# Altium schematic sheet ADC.SchDoc
size A4; SheetNumber: 2; SheetTotal: 6
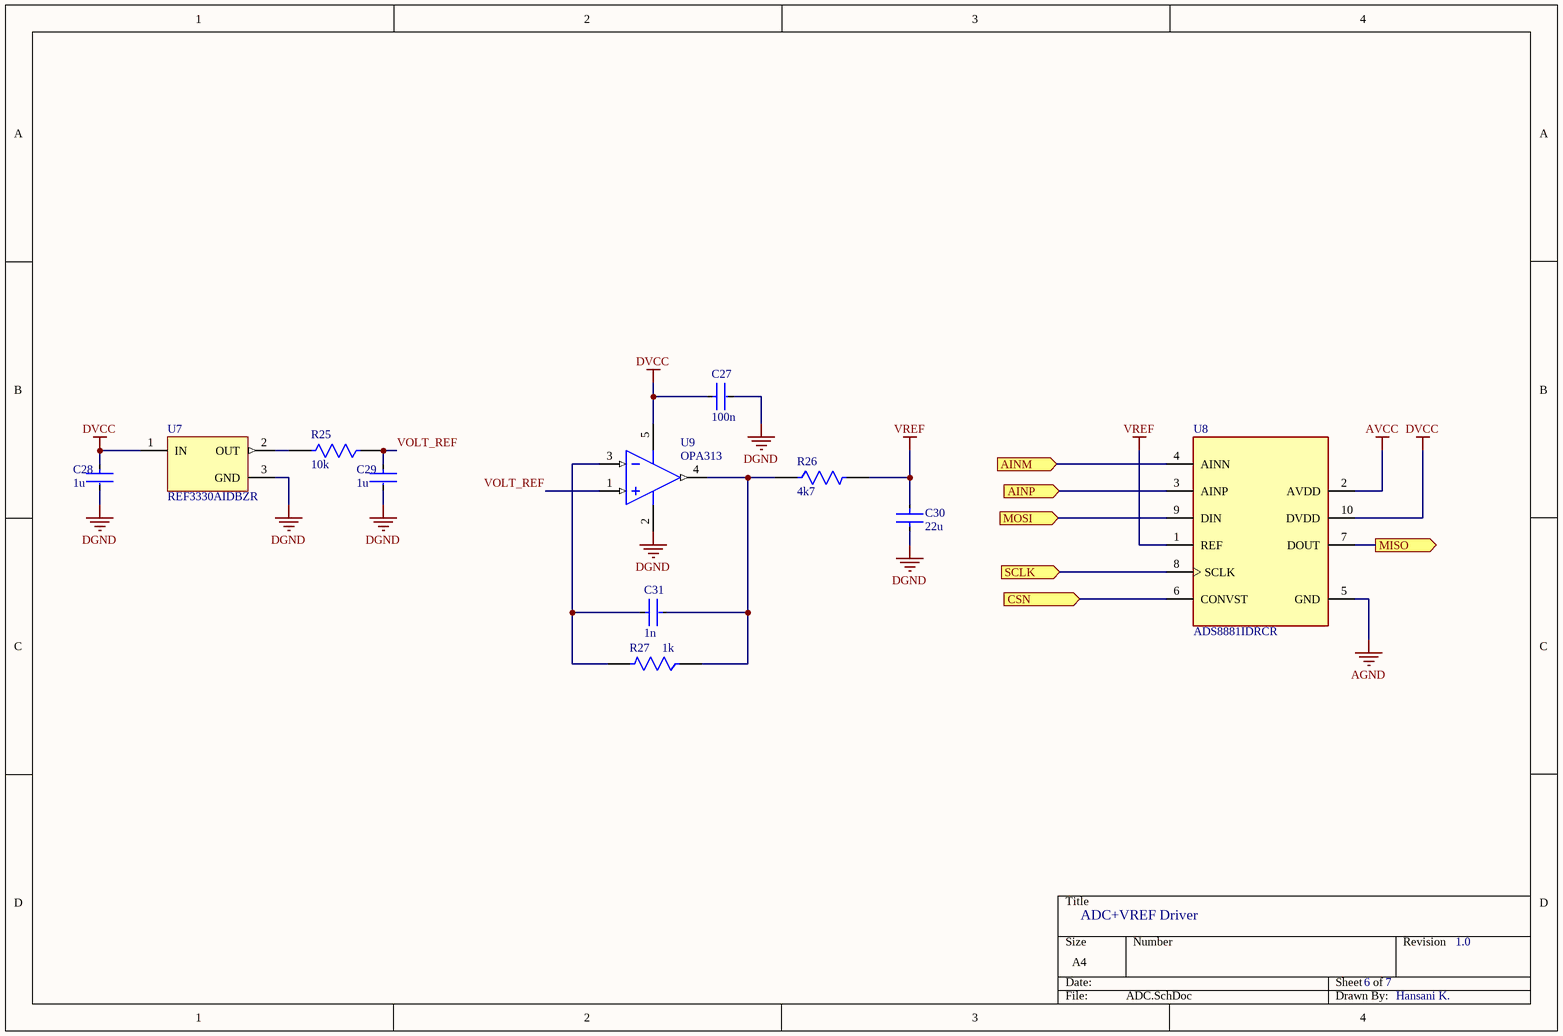
[diagram p0: ADC.SchDoc]

## Parts
C27  100n  [FP-GRM155-0_05-MFG]
C28  1u  [FP-0603-L_1_6_0_15-W_0_81-IPC_A]
C29  1u  [FP-0603-L_1_6_0_15-W_0_81-IPC_A]
C30  22u  [PCBComponent_1]
C31  1n  [PCBComponent_1]
R25  10k  [FP-CRGCQ0805-IPC_C]
R26  4k7  [FP-RN73R2A-IPC_C]
R27  1k  [FP-PATT0805-MFG]
U7  REF3330AIDBZR  [DBZ0003A_L]
U8  ADS8881IDRCR  [ADS8881IDRCR]
U9  OPA313  [DCK0005A_L]

## Ports
AINM (in, see Wireless_ECG_Monitor[3B], Input_Driver_ADC[3C]), AINP (in, see Wireless_ECG_Monitor[3B], Input_Driver_ADC[3B]), CSN (in, see Wireless_ECG_Monitor[3B], MCU[1C]), MISO (out, see Wireless_ECG_Monitor[3B], MCU[1C]), MOSI (in, see Wireless_ECG_Monitor[3B], MCU[1C]), SCLK (in, see Wireless_ECG_Monitor[3B], MCU[1C])

## Nets
AGND: U8.5(GND)
AVCC: U8.2(AVDD)
DGND: C27.2 C28.2 C29.2 C30.1 U7.3(GND) U9.2(V-)
DVCC: C27.1 C28.1 U7.1(IN) U8.10(DVDD) U9.5(V+)
VREF: C30.2 R26.2 U8.1(REF)
AINM: U8.4(AINN) ; port AINM
AINP: U8.3(AINP) ; port AINP
CSN: U8.6(CONVST) ; port CSN
MISO: U8.7(DOUT) ; port MISO
MOSI: U8.9(DIN) ; port MOSI
SCLK: U8.8(SCLK) ; port SCLK
VOLT_REF: C29.1 R25.1 U9.1(IN+)
NetC31_1: C31.1 R27.2 U9.3(IN-)
NetC31_2: C31.2 R26.1 R27.1 U9.4(OUT)
NetR25_2: R25.2 U7.2(OUT)

## Notes on the sheet
- ADC+VREF Driver
- 6
- 7
- 1.0
- Hansani K.

## Library data of the parts
C27 = CMP-06035-040303-1: Chip Multilayer Ceramic Capacitors for General Purpose, 0402, 0.10uF, B, 10%, 20%, 50V
C28 C29 = CMP-2006-04474-2: General Purpose Ceramic Capacitor, 0603, 1uF, 10%, X5R, 15%, 6.3V; Insulation Resistance: 100GR; Dissipation Factor: 5%; Package Quantity: 1; Mount: Surface Mount; Series: -; Number of Pins: 2; Length: 1.6mm; RoHS Compliant: Yes; Capacitance: 1uF; Depth: 0.81mm; Case Code (Imperial): 0603; Lead Free: Lead Free; Max Operating Temperature: 85°C; Case Code (Metric): 1608; Min Operating Temperature: -55°C; Contact Plating: Tin; Voltage: 6.3V; Tolerance: 10%; Width: 0.032inch; Voltage Rating (DC): 6.3V; Voltage Rating: 6.3V; Termination: SMD/SMT; Radiation Hardening: No; Case/Package: 0603; Thickness: 0.035inch; Height: 0.9mm; REACH SVHC: No SVHC; Packaging: Tape and Reel; Construction: Flat; Dielectric: X5R
C30 = CL21A226MAYNNNE: Ceramic Capacitor, Multilayer, Ceramic, 25V, 20% +Tol, 20% -Tol, X5R, +-15% TC, 22uF, Surface Mount, 0805 inch; Manufacturer: Samsung Electro-Mechanics; Value: 22µF; Supplier: Avnet; Supplier Part Number: CL21A226MAYNNNE; Manufacturer Part Number: CL21A226MAYNNNE; RoHS: Compliant; Category: Ceramic Capacitors; Stock: 1176000; Pricing: 2000=0.03409, 4000=0.03392, 8000=0.03375, 16000=0.03357, 32000=0.0334 (USD); Case/Package: 0805; China RoHS: Compliant; Dielectric: X5R; Dielectric Material: Ceramic; Height: 1.25mm; Length: 2mm; Lifecycle Status: Production; Material: Ceramic; Max Operating Temperature: 85°C; Min Operating Temperature: -55°C; Mounting Technology: Surface Mount; Number of Terminals: 2; REACH SVHC: Yes; Schedule B: 8532240020; Tolerance: 20%; Voltage Rating: 25V; Voltage Rating (DC): 25V; Width: 1.25mm; ComponentLink1URL: https://datasheet.octopart.com:443/CL21A226MAYNNNE-Samsung-Electro-Mechanics-datasheet-137343010.pdf?src-supplier=IHS; ComponentLink1Description: https://datasheet.octopart.com:443/CL21A226MAYNNNE-Samsung-Electro-Mechanics-datasheet-137343010.pdf?src-supplier=IHS; ComponentLink2URL: https://datasheet.octopart.com:443/CL21A226MAYNNNE-Samsung-Electro-Mechanics-datasheet-137126787.pdf?src-supplier=Newark; ComponentLink2Description: https://datasheet.octopart.com:443/CL21A226MAYNNNE-Samsung-Electro-Mechanics-datasheet-137126787.pdf?src-supplier=Newark; ComponentLink3URL: https://datasheet.octopart.com/CL21A226MAYNNNE-Samsung-Electro-Mechanics-datasheet-97040617.pdf; ComponentLink3Description: https://datasheet.octopart.com/CL21A226MAYNNNE-Samsung-Electro-Mechanics-datasheet-97040617.pdf; ComponentLink4URL: https://datasheet.octopart.com/CL21A226MAYNNNE-Samsung-Electro-Mechanics-datasheet-8324245.pdf; ComponentLink4Description: https://datasheet.octopart.com/CL21A226MAYNNNE-Samsung-Electro-Mechanics-datasheet-8324245.pdf; ComponentLink5URL: https://datasheet.octopart.com/General-Multilayer-Ceramic-Capacitors-Samsung-datasheet-family-111.pdf; ComponentLink5Description: https://datasheet.octopart.com/General-Multilayer-Ceramic-Capacitors-Samsung-datasheet-family-111.pdf; ComponentLink6URL: https://datasheet.octopart.com:443/CL21A226MAYNNNE-Samsung-datasheet-8326407.pdf?src-supplier=TME; ComponentLink6Description: https://datasheet.octopart.com:443/CL21A226MAYNNNE-Samsung-datasheet-8326407.pdf?src-supplier=TME; ComponentLink7URL: https://datasheet.octopart.com:443/CL21A226MAYNNNE-Samsung-Electro-Mechanics-datasheet-149154243.pdf?src-supplier=Future+Electronics; ComponentLink7Description: https://datasheet.octopart.com:443/CL21A226MAYNNNE-Samsung-Electro-Mechanics-datasheet-149154243.pdf?src-supplier=Future+Electronics; ComponentLink8URL: http://sigma.octopart.com:80/rohs_certificate/General-Multilayer-Ceramic-Capacitors-Samsung-family-110.pdf?src-supplier=Compliance+Statements; ComponentLink8Description: http://sigma.octopart.com:80/rohs_certificate/General-Multilayer-Ceramic-Capacitors-Samsung-family-110.pdf?src-supplier=Compliance+Statements; ComponentLink9URL: http://sigma.octopart.com:80/rohs_statement/General-Multilayer-Ceramic-Capacitors-Samsung-family-132.pdf?src-supplier=Compliance+Statements; ComponentLink9Description: http://sigma.octopart.com:80/rohs_statement/General-Multilayer-Ceramic-Capacitors-Samsung-family-132.pdf?src-supplier=Compliance+Statements; ComponentLink10URL: http://sigma.octopart.com:80/reach_statement/General-Multilayer-Ceramic-Capacitors-Samsung-family-133.pdf?src-supplier=Compliance+Statements; ComponentLink10Description: http://sigma.octopart.com:80/reach_statement/General-Multilayer-Ceramic-Capacitors-Samsung-family-133.pdf?src-supplier=Compliance+Statements
C31 = CS0805KRX7RBBB102: Ceramic Capacitor, Multilayer, Ceramic, 500V, 10% +Tol, 10% -Tol, X7R, 15% TC, 0.001uF, Surface Mount, 0805; Manufacturer: Yageo Group; Value: 1nF; Supplier: DigiKey; Supplier Part Number: 311-3593-1-ND; Manufacturer Part Number: CS0805KRX7RBBB102; RoHS: Compliant; Category: Ceramic Capacitors; Stock: 13349; Pricing: 1=0.32, 10=0.191, 50=0.14, 100=0.1241, 500=0.0976, 1000=0.08941 (USD); Case/Package: 0805; China RoHS: Compliant; Dielectric Material: Ceramic; Features: Soft Termination; Height: 850µm; Length: 2mm; Lifecycle Status: Production; Max Operating Temperature: 125°C; Min Operating Temperature: -55°C; Mounting Technology: Surface Mount; Number of Terminals: 2; REACH SVHC: Yes; Thickness: 990.6µm; Tolerance: 10%; Voltage Rating: 500V; Voltage Rating (DC): 500V; Width: 1.25mm; ComponentLink1URL: https://datasheet.octopart.com:443/CS0805KRX7RBBB102-Yageo-datasheet-176133326.pdf?src-supplier=IHS; ComponentLink1Description: https://datasheet.octopart.com:443/CS0805KRX7RBBB102-Yageo-datasheet-176133326.pdf?src-supplier=IHS; ComponentLink2URL: https://datasheet.octopart.com:443/CS0805KRX7RBBB102-Yageo-datasheet-158410602.pdf?src-supplier=Newark; ComponentLink2Description: https://datasheet.octopart.com:443/CS0805KRX7RBBB102-Yageo-datasheet-158410602.pdf?src-supplier=Newark; ComponentLink3URL: https://datasheet.octopart.com:443/CS0805KRX7RBBB102-Yageo-datasheet-182050863.pdf?src-supplier=Newark; ComponentLink3Description: https://datasheet.octopart.com:443/CS0805KRX7RBBB102-Yageo-datasheet-182050863.pdf?src-supplier=Newark; ComponentLink4URL: http://sigma.octopart.com:80/rohs_statement/Yageo-company-2.pdf?src-supplier=Compliance+Statements; ComponentLink4Description: http://sigma.octopart.com:80/rohs_statement/Yageo-company-2.pdf?src-supplier=Compliance+Statements; ComponentLink5URL: http://sigma.octopart.com:80/conflict_mineral_statement/Yageo-company-3.pdf?src-supplier=Compliance+Statements; ComponentLink5Description: http://sigma.octopart.com:80/conflict_mineral_statement/Yageo-company-3.pdf?src-supplier=Compliance+Statements
R25 = CMP-03211-002989-1: CRGCQ 0805 10K 5%; Manufacturer Part Number: CRGCQ0805J10K; Manufacturer: TE Connectivity; Voltage Rating: 150V; Temperature Coefficient: ±100ppm/°C; Resistance: 10KΩ; Value: 10KΩ; Power Rating: 0.125W; Tolerance: 0.05; Automotive Grade: Grade 914; Height: 0.65mm; Lead Free: Yes; Temperature Range High: +155°C; Composition: Thick Film; Temperature Range Low: -55°C; Ambient Temperature Range High: +70°C; Temperature: -55°C to +155°C; Package: CRGCQ0805; Device Class L2: Resistors; RoHS: TRUE; ComponentLink2URL: https://www.te.com/commerce/DocumentDelivery/DDEController?Action=showdoc&DocId=Data+Sheet%7F1773204-3%7F1%7Fpdf%7FEnglish%7FENG_DS_1773204-3_1.pdf%7F4-2176341-923; Series: CRGCQ; Device Class L1: Passive Components; Ipc Land Pattern Name: RESC200125X55; ComponentLink2Description: Datasheet; Category: Res; Digikey Description: CRGCQ 0805 10K 5%; Mouser Description: Res Thick Film 0805 10K Ohm 5% 0.125W(1/8W) ±100ppm/C Pad SMD Automotive T/R; Automotive: Yes; Octopart: https://octopart.com/crgcq0805j10k-te+connectivity-91018201; Device Class L3: Chip SMD Resistors
R26 = CMP-04015-010540-1: 4.7kΩ ±0.1% 0.125W, 1/8W Chip Resistor 0805 (2012 Metric) Moisture Resistant Thin Film
R27 = CMP-02407-000013-1: RES SMD 1K OHM 0.1% 1/5W 0805; Manufacturer Part Number: PATT0805E1001BGT1; Manufacturer: Vishay; Automotive Grade: Grade 0; Resistance: 1kΩ; Voltage Rating: 100V; Temperature Coefficient: 25ppm/°C; Value: 1kΩ; Power Rating: 200mW; ComponentLink2Description: Datasheet; Device Class L1: Passive Components; Footprint Url: https://www.vishay.com/docs/60119/landpatterns.pdf; Lead Free: Yes; Device Class L2: Resistors; Tolerance: 0.1%; Temperature: -55°C to +250°C; Height: 0.018inch; Series: PATT; Device Class L3: Chip SMD Resistors; Temperature Range High: +250°C; RoHS: TRUE; Octopart: https://octopart.com/patt0805e1001bgt1-vishay-34963130; Category: Res; Digikey Description: RES SMD 1K OHM 0.1% 1/5W 0805; Automotive: Yes; Package: PATT0805; ComponentLink2URL: https://www.vishay.com/docs/60124/patt.pdf; Temperature Range Low: -55°C; Composition: Thin Film; Ipc Land Pattern Name: RESC203127X38
U7 = CMP-0367-00142-2: 30 ppm / degC Drift, 3.9 uA Voltage Reference, -40 to 125 degC, 3-pin SOT-23 (DBZ), Green (RoHS & no Sb/Br); Manufacturer: Texas Instruments; Temp Coeff(Max)(ppm/ degree C): 30; Temp Coeff(Typ)(ppm/ degree C): 8; Iout/Iz(Max)(mA): 5; VO(V): 3; Initial Accuracy @ 25/deg C(%): 0.15; VI(Min)(V): 3.16; SubFamily: Series Voltage Reference; Rating: Catalog; VI(Max)(V): 5.5; ComponentLink1URL: http://www.ti.com/; PackageDescription: 3-Pin Plastic Small Outline, Body 2.92 x 1.3 mm, Pitch 0.95 mm; Code_JEDEC: TO-236; Eco-Plan: Green (RoHS & no Sb/Br); Iq(Max)(uA): 5; ComponentLink2URL: http://www.ti.com/general/docs/lit/getliterature.tsp?genericPartNumber=REF3330&fileType=pdf; PackageVersion: 4203227/B; ComponentLink3Description: Package Specification; ComponentLink3URL: http://www.ti.com/litv/pdf/mpds108a; PartNumber: REF3330AIDBZR; ComponentLink1Description: Manufacturer URL; Mounting Technology: Surface Mount; DatasheetVersion: SBOS392A; ComponentLink2Description: Datasheet; PackageReference: DBZ0003A
U8 = ADS8881IDRCR: IC ADC 18BIT SAR 10VSON 18 Bit Analog to Digital Converter 1 Input 1 SAR 10-VSON (3x3); Manufacturer: Texas Instruments; Manufacturer Lifecycle Status: ACTIVE; Integral Nonlinearity (INL): 3LSB; Interface: SPI; Max Power Dissipation: 7.2mW; Max Supply Voltage: 3.6V; Min Supply Voltage: 2.7V; Number of A/D Converters: 1; Number of Bits: 18; Operating Supply Voltage: 3V; Polarity: Unipolar; Power Consumption: 5.5mW; Resolution: 2.25B; Sampling Rate: 1Msps; Signal to Noise Ratio (SNR): 100dB; Supply Type: Analog, Digital, Single; Supplier: DigiKey; Supplier Part Number: 296-37899-1-ND; Manufacturer Part Number: ADS8881IDRCR; RoHS: Compliant; Category: Analog to Digital Converters (ADCs); Stock: 2659; Pricing: 1=27.35, 10=22.043, 25=20.718, 100=19.2615, 250=18.56736, 500=18.14896 (USD); Contact Plating: Gold; Height: 1mm; Lead Free: Lead Free; Length: 3mm; Lifecycle Status: Production; Max Operating Temperature: 85°C; Min Operating Temperature: -40°C; Mounting Technology: Surface Mount; Number of Analog Inputs: 1; Number of Converters: 1; Number of Inputs: 1; Pins: 10; Packaging: Cut Tape (CT); Power Dissipation: 5.5mW; Thickness: 900µm; Width: 3mm; ComponentLink1URL: https://sigma.octopart.com:443/104365911/technical_drawing/Texas-Instruments-ADS8881IDRCR.pdf?src-supplier=Texas+Instruments; ComponentLink1Description: https://sigma.octopart.com:443/104365911/technical_drawing/Texas-Instruments-ADS8881IDRCR.pdf?src-supplier=Texas+Instruments; ComponentLink2URL: https://octopart.com:443/opatz8j6/c1?t=OJiepehpYdZbnUBuj5ZsXd9OtmaNi9mPDKLra4dEngeW_5IpLeTn_lwsLoJA99-cQhzum8g0xLlHYwCm0lW9Zjy8UN_5onRLOZ46rm_QCEZiSyzFtGZxLVKfKM577AioPQ2jqFNkCrtcQXQH5GcpnNQfJmry3X-GUxgd3Gw1PsHvFxEbQLg0z4QSci1p9Y8rFEjFNmrPi3Qrgt59q1qU13L-TL1ykCeYcHSkXNu_7y_lUmdmEFZ60tULHYtO1gFDB7oVT5CcNqRxnQSTzSFksqzSi4X7TxyruA-Xrl7SOjQxqk9mCBuPXeNUya7H_2moI9808XSYoo3zuyNKrBANUZvW5OX2MgUzdzp-EbTZzgBUyYKLxaCyXy5Fcxsd8oMNuxongnU&src-supplier=Texas+Instruments; ComponentLink2Description: https://octopart.com:443/opatz8j6/c1?t=OJiepehpYdZbnUBuj5ZsXd9OtmaNi9mPDKLra4dEngeW_5IpLeTn_lwsLoJA99-cQhzum8g0xLlHYwCm0lW9Zjy8UN_5onRLOZ46rm_QCEZiSyzFtGZxLVKfKM577AioPQ2jqFNkCrtcQXQH5GcpnNQfJmry3X-GUxgd3Gw1PsHvFxEbQLg0z4QSci1p9Y8rFEjFNmrPi3Qrgt59q1qU13L-TL1ykCeYcHSkXNu_7y_lUmdmEFZ60tULHYtO1gFDB7oVT5CcNqRxnQSTzSFksqzSi4X7TxyruA-Xrl7SOjQxqk9mCBuPXeNUya7H_2moI9808XSYoo3zuyNKrBANUZvW5OX2MgUzdzp-EbTZzgBUyYKLxaCyXy5Fcxsd8oMNuxongnU&src-supplier=Texas+Instruments; ComponentLink3URL: https://datasheet.octopart.com:443/ADS8881IDRCR-Texas-Instruments-datasheet-37706426.pdf?src-supplier=Texas+Instruments; ComponentLink3Description: https://datasheet.octopart.com:443/ADS8881IDRCR-Texas-Instruments-datasheet-37706426.pdf?src-supplier=Texas+Instruments; ComponentLink4URL: https://datasheet.octopart.com:443/ADS8881IDRCR-Texas-Instruments-datasheet-27303705.pdf?src-supplier=Texas+Instruments; ComponentLink4Description: https://datasheet.octopart.com:443/ADS8881IDRCR-Texas-Instruments-datasheet-27303705.pdf?src-supplier=Texas+Instruments; ComponentLink5URL: https://datasheet.octopart.com:443/ADS8881IDRCR-Texas-Instruments-datasheet-21255708.pdf?src-supplier=Texas+Instruments; ComponentLink5Description: https://datasheet.octopart.com:443/ADS8881IDRCR-Texas-Instruments-datasheet-21255708.pdf?src-supplier=Texas+Instruments; ComponentLink6URL: https://datasheet.octopart.com:443/ADS8881IDRCR-Texas-Instruments-datasheet-16617084.pdf?src-supplier=Texas+Instruments; ComponentLink6Description: https://datasheet.octopart.com:443/ADS8881IDRCR-Texas-Instruments-datasheet-16617084.pdf?src-supplier=Texas+Instruments; ComponentLink7URL: https://datasheet.octopart.com:443/ADS8881IDRCR-Texas-Instruments-datasheet-15896027.pdf?src-supplier=Texas+Instruments; ComponentLink7Description: https://datasheet.octopart.com:443/ADS8881IDRCR-Texas-Instruments-datasheet-15896027.pdf?src-supplier=Texas+Instruments; ComponentLink8URL: https://sigma.octopart.com:443/49250247/technical_drawing/Texas-Instruments-ADS8881IDRCR.pdf?src-supplier=Texas+Instruments; ComponentLink8Description: https://sigma.octopart.com:443/49250247/technical_drawing/Texas-Instruments-ADS8881IDRCR.pdf?src-supplier=Texas+Instruments; ComponentLink9URL: https://datasheet.octopart.com:443/ADS8881IDRCR-Texas-Instruments-datasheet-164412682.pdf?src-supplier=SHENGYU+ELECTRONICS; ComponentLink9Description: https://datasheet.octopart.com:443/ADS8881IDRCR-Texas-Instruments-datasheet-164412682.pdf?src-supplier=SHENGYU+ELECTRONICS; ComponentLink10URL: http://sigma.octopart.com:80/conflict_mineral_statement/Texas-Instruments-company-63.pdf?src-supplier=Compliance+Statements; ComponentLink10Description: http://sigma.octopart.com:80/conflict_mineral_statement/Texas-Instruments-company-63.pdf?src-supplier=Compliance+Statements; ComponentLink11URL: http://sigma.octopart.com:80/reach_statement/Texas-Instruments-company-64.pdf?src-supplier=Compliance+Statements; ComponentLink11Description: http://sigma.octopart.com:80/reach_statement/Texas-Instruments-company-64.pdf?src-supplier=Compliance+Statements
U9 = CMP-0810-00005-2: 1-MHz, Micropower, Low-Noise, Rail-to-Rail I/O Operational Amplifier, 1.8 to 5.5 V, -40 to 125 degC, 5-pin SOT23 (DCK5), Green (RoHS & no Sb/Br); Manufacturer: Texas Instruments; PartNumber: OPA313IDCKR; Iq per channel(Max)(mA): 0.06; Total Supply Voltage(Min)(+5V is 5, +/-5V is 10): 1.8; Slew Rate(Typ)(V/us): 0.5; Packing: LARGE T&R; CMRR(Min)(dB): 70; Rating: Catalog; SubFamily: Low Input Bias Current Amp (<=10pA), Low Power Amp (<=500uA); Total Supply Voltage(Max)(+5V is 5, +/-5V is 10): 5.5; GBW(Typ)(MHz): 1; Vio (25C)(Max)(mV): 2.5; Offset Drift(Typ)(uV/C): 2; PackageDescription: 5-Pin Plastic Small Outline, Body 2 x 1.25 mm, Pitch 0.65 mm; ComponentLink1URL: http://www.ti.com/; Mounting Technology: Surface Mount; ComponentLink3URL: http://www.ti.com/litv/pdf/mpds025f; ComponentLink1Description: Manufacturer URL; ComponentLink2Description: Datasheet; Code_JEDEC: MO-203; ComponentLink2URL: http://www.ti.com/lit/ds/symlink/opa313.pdf; Eco-Plan: Green (RoHS & no Sb/Br); PackageVersion: 4093553-3/G, 01/2007; DatasheetVersion: SBOS649C; PackageReference: DCK0005A; ComponentLink3Description: Package Specification; Number of Channels: 1